# Altium schematic sheet DDR3_Memory.SchDoc
size A4; SheetNumber: 4; SheetTotal: 9
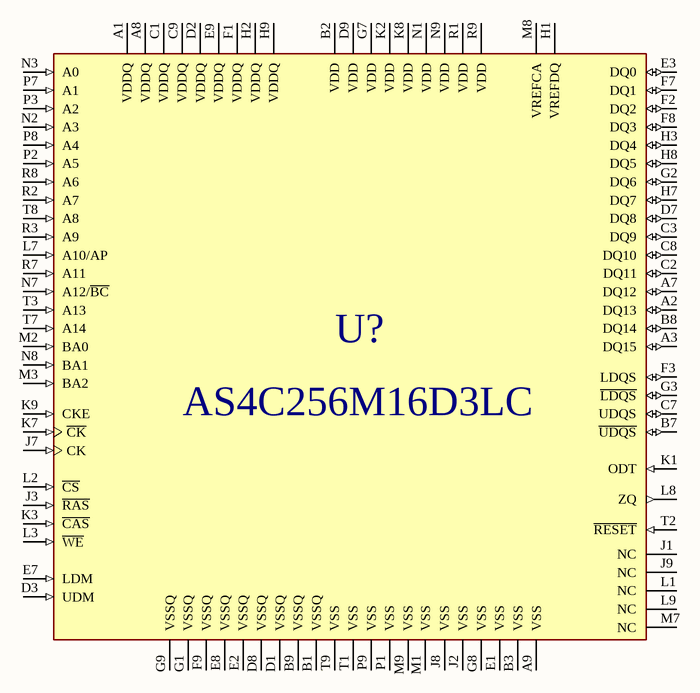
[diagram p0: DDR3_Memory.SchDoc]

## Parts
U?  AS4C256M16D3LC  [FBGA-96]

## Nets

Not connected (* = marked no-connect by the designer): U? A1(VDDQ) A2(DQ13) A3(DQ15) A7(DQ12) A8(VDDQ) A9(VSS) B1(VSSQ) B2(VDD) B3(VSS) B7(~{UDQS}) B8(DQ14) B9(VSSQ) C1(VDDQ) C2(DQ11) C3(DQ9) C7(UDQS) C8(DQ10) C9(VDDQ) D1(VSSQ) D2(VDDQ) D3(UDM) D7(DQ8) D8(VSSQ) D9(VDD) E1(VSS) E2(VSSQ) E3(DQ0) E7(LDM) E8(VSSQ) E9(VDDQ) F1(VDDQ) F2(DQ2) F3(LDQS) F7(DQ1) F8(DQ3) F9(VSSQ) G1(VSSQ) G2(DQ6) G3(~{LDQS}) G7(VDD) G8(VSS) G9(VSSQ) H1(VREFDQ) H2(VDDQ) H3(DQ4) H7(DQ7) H8(DQ5) H9(VDDQ) J1(NC) J2(VSS) J3(~{RAS}) J7(CK) J8(VSS) J9(NC) K1(ODT) K2(VDD) K3(~{CAS}) K7(~{CK}) K8(VDD) K9(CKE) L1(NC) L2(~{CS}) L3(~{WE}) L7(A10/AP) L8(ZQ) L9(NC) M1(VSS) M2(BA0) M3(BA2) M7(NC) M8(VREFCA) M9(VSS) N1(VDD) N2(A3) N3(A0) N7(A12/~{BC}) N8(BA1) N9(VDD) P1(VSS) P2(A5) P3(A2) P7(A1) P8(A4) P9(VSS) R1(VDD) R2(A7) R3(A9) R7(A11) R8(A6) R9(VDD) T1(VSS) T2(~{RESET}) T3(A13) T7(A14) T8(A8) T9(VSS)

## Library data of the parts
U? = DDR3 AS4C256M16D3LC: 256M x 16 bit DDR3L Synchronous DRAM (SDRAM); ComponentLink1Description: DataSheet; ComponentLink1URL: https://www.alliancememory.com/wp-content/uploads/pdf/ddr3/AllianceMemory_4G_DDR3L_AS4C256M16D3LC_March2020_Rev1.0.pdf